# EAGLE design bt-audio-receiver (EAGLE 9.2.2)
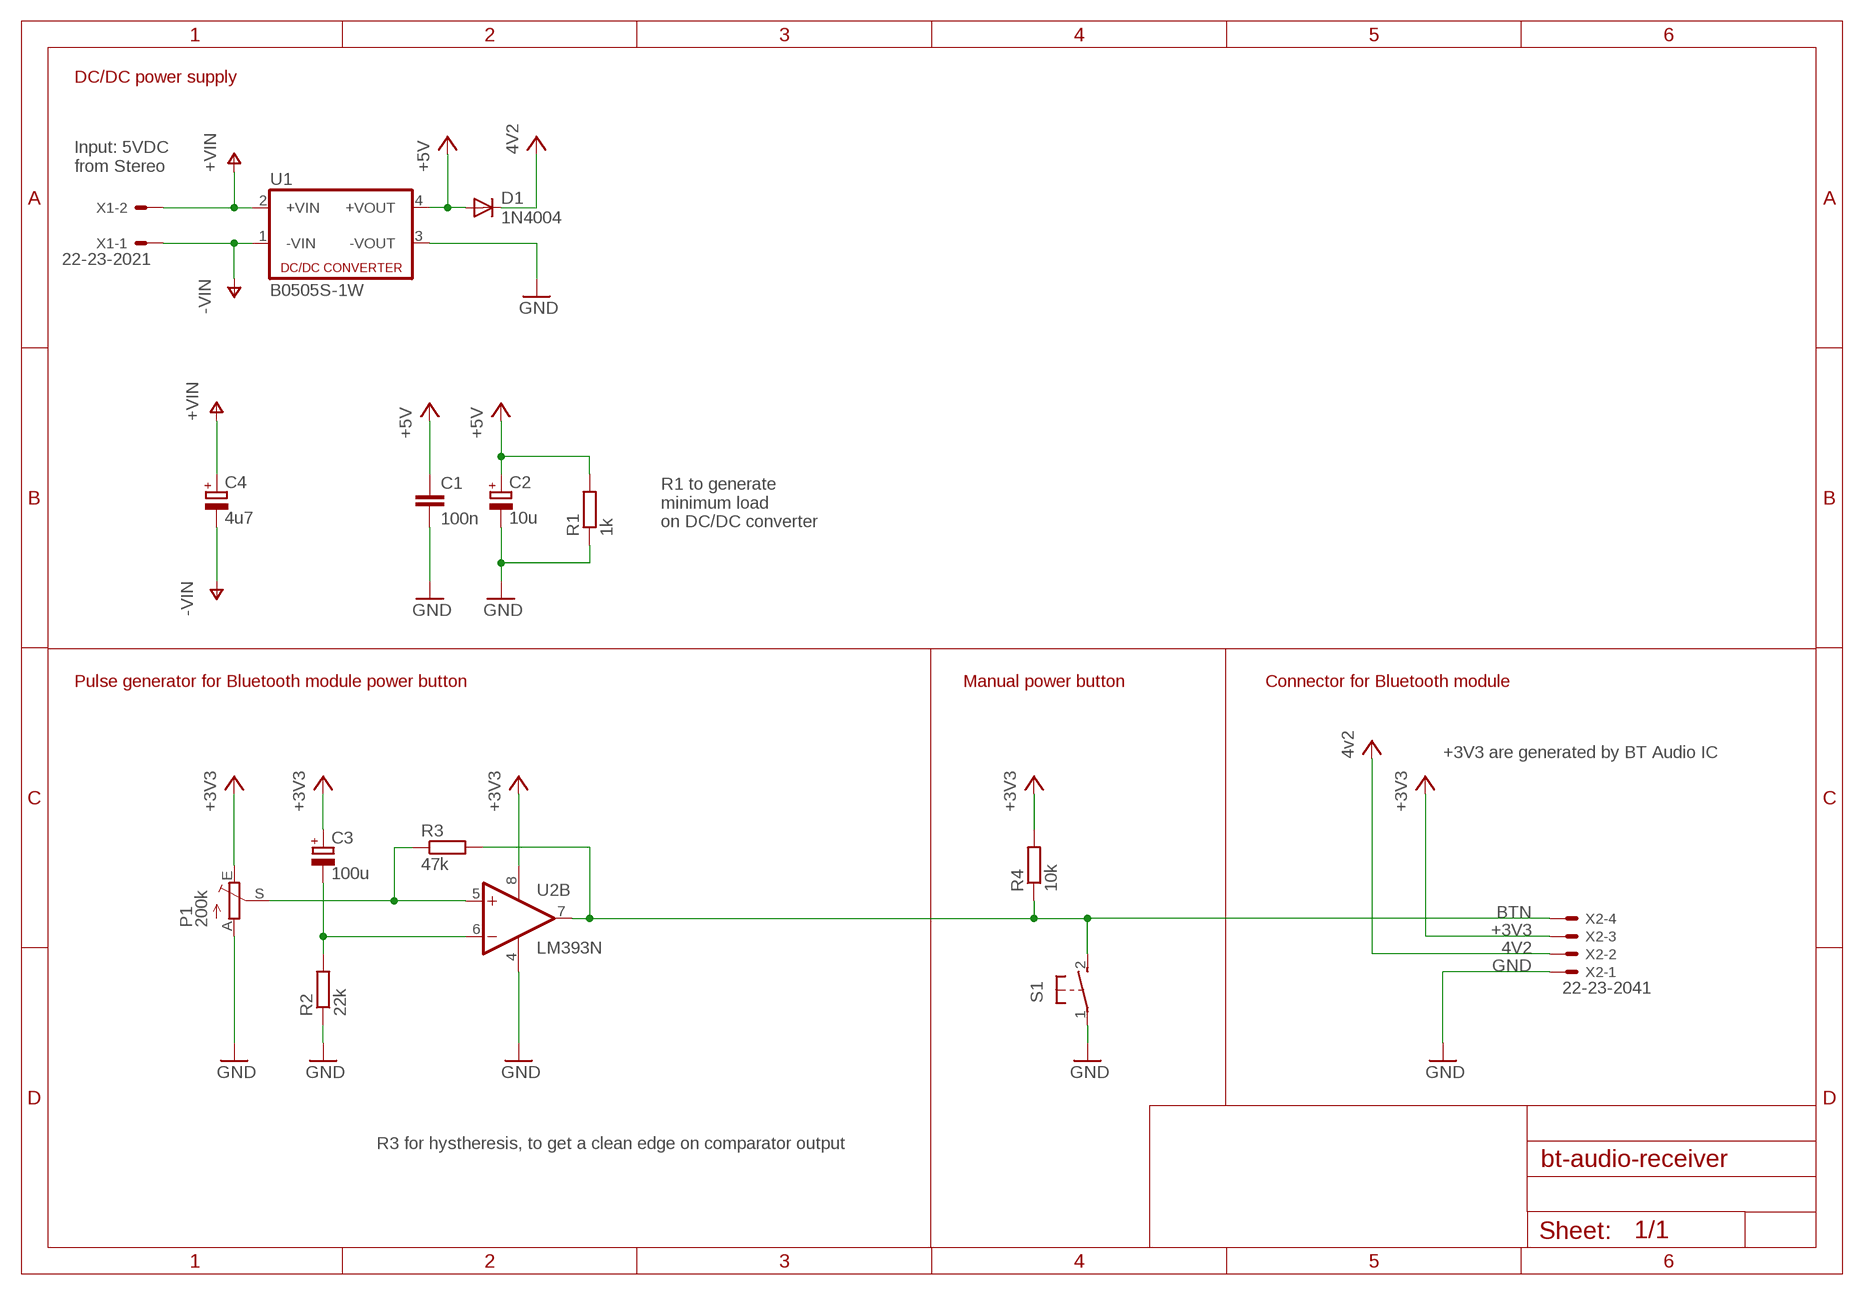
[diagram p0: schematic, sheet 1]

## Parts
C1  100n  C-EU025-025X050  [C025-025X050]
C2  10u  CPOL-EUE2-4  [E2-4]
C3  100u  CPOL-EUE2.5-5  [E2,5-5]
C4  4u7  CPOL-EUE2-4  [E2-4]
D1  1N4004  [DO41-10]
P1  200k  TRIM_EU-B25P  [B25P]
R1  1k  R-EU_0204/2V  [0204V]
R2  22k  R-EU_0204/7  [0204/7]
R3  47k  R-EU_0204/5  [0204/5]
R4  10k  R-EU_0204/2V  [0204V]
S1  DTS-3  [DTS-3]
U1  B0505S-1W  VA-0505S1  [4SIL]
U2  LM393N  [DIL08]
X1  22-23-2021  [22-23-2021]
X2  22-23-2041  [22-23-2041]

## Nets
4V2: D1.C X2.2 ; supply symbol labelled 4v2
+3V3: C3.+ P1.E R4.2 U2.8(P:V+) X2.3
+5V: C1.1 C2.+ D1.A R1.2 U1.4(+VOUT)
+VIN: C4.+ U1.2(+VIN) X1.2
-VIN: C4.- U1.1(-VIN) X1.1
BTN: R3.2 R4.1 S1.2 U2.7(B:OUT) X2.4
GND: C1.2 C2.- P1.A R1.1 R2.1 S1.1 U1.3(-VOUT) U2.4(P:V-) X2.1
N$1: C3.- R2.2 U2.6(B:-IN)
N$2: P1.S R3.1 U2.5(B:+IN)
Unconnected: U2.1(A:OUT) U2.2(A:-IN) U2.3(A:+IN)

## Notes on the sheet
- DC/DC power supply
- Input: 5VDC
  from Stereo
- R1 to generate
  minimum load
  on DC/DC converter
- Pulse generator for Bluetooth module power button | Manual power button | Connector for Bluetooth module
- +3V3 are generated by BT Audio IC
- R3 for hystheresis, to get a clean edge on comparator output

## Library data of the parts
C1 = rcl:C-EU: CAPACITOR, European symbol; SPICEPREFIX: C
C2-C4 = rcl:CPOL-EU: POLARIZED CAPACITOR, European symbol; SPICEPREFIX: C
D1 = diode:1N4004: DIODE general purpose rectifier, 1 A
P1 = pot:TRIM_EU-: POTENTIOMETER
R1-R4 = rcl:R-EU_: RESISTOR, European symbol; SPICEPREFIX: R
S1 = switch-tact:DTS-3
U1 = dc-dc-converter:VA-*?: DC DC Converter Single Output, 1 Watt Motien Technology Co.,Ltd. Source: Data sheet <http://www.motien.com.tw/data_sheet/VA-1%28H%29.pdf>; OC_FARNELL: unknown; OC_NEWARK: unknown
U2 = linear:LM393: COMPARATOR
X1 = con-molex:22-23-2021: .100" (2.54mm) Center Header - 2 Pin; MF: MOLEX; MPN: 22-23-2021; OC_FARNELL: 1462926; OC_NEWARK: 25C3832
X2 = con-molex:22-23-2041: .100" (2.54mm) Center Header - 4 Pin; MF: MOLEX; MPN: 22-23-2041; OC_FARNELL: 1462920; OC_NEWARK: 38C0355

## Board
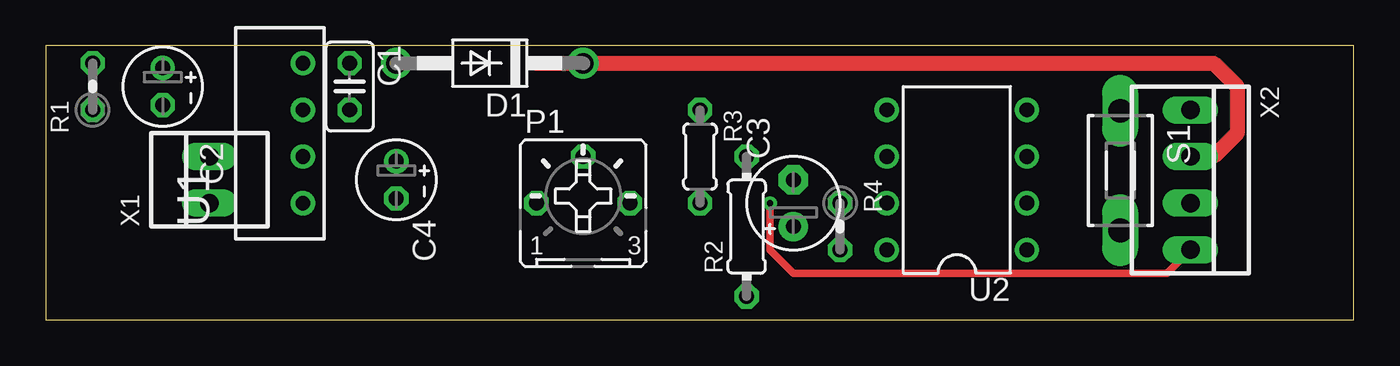
[diagram p1: board, top side]
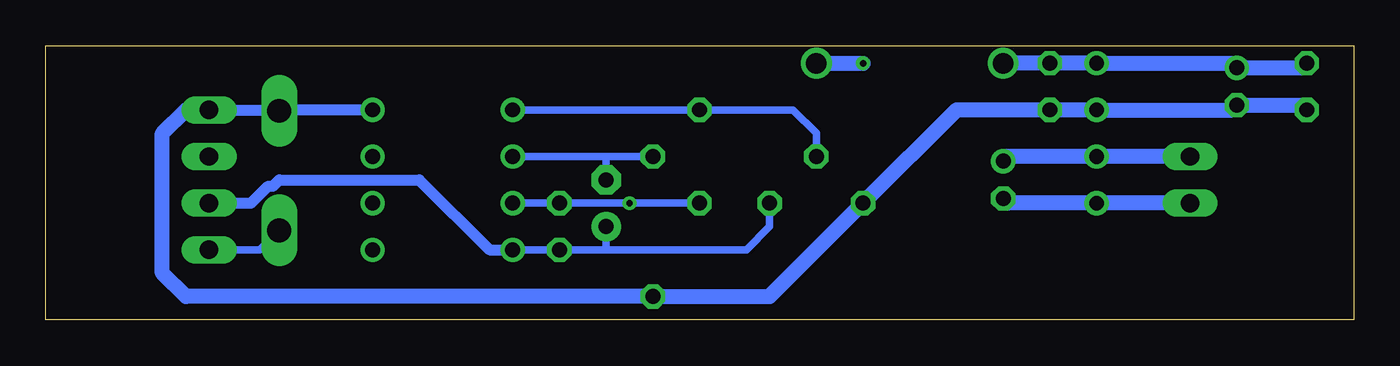
[diagram p2: board, bottom side, seen from below]

Size 71.1 x 14.91 mm. Coordinates in mm from the lower left corner, seen from the top.
Outline: 0,0 71.1,0 71.1,14.91 0,14.91 0,0
Copper layers (1*16): Top 0.035mm / dielectric 1.5mm / Bottom 0.035mm
Design rules "default": minimum track width 6mil, minimum drill 0.35mm, track to track 6mil, track to pad 6mil, pad to pad 6mil, via to via 6mil, smd to smd 6mil, copper to edge 40mil, drill to drill 6mil, minimum pad ring 10mil, minimum via ring 8mil, stop-mask expansion 4mil, vias tented up to drill 0mil, thermal gap 10mil

### Footprints (pad centres in the part's own frame; a part is rotated, then mirrored left to right if it is on the bottom)
C025-025X050 = drill 0.813 octagon: 1 -1.27,0; 2 1.27,0
E2-4 = drill 0.813 pad 1.27: + -1.016,0 | drill 0.813 pad 1.27 octagon: - 1.016,0
E2,5-5 = drill 0.813 pad 1.6: + -1.27,0 | drill 0.813 pad 1.6 octagon: - 1.27,0
DO41-10 = drill 1.118: A 5.08,0; C -5.08,0
B25P = drill 0.813 octagon: A -2.54,0; E 2.54,0; S 0,2.54
0204V = drill 0.813 octagon: 1 -1.27,0; 2 1.27,0
0204/7 = drill 0.813 octagon: 1 -3.81,0; 2 3.81,0
0204/5 = drill 0.813 octagon: 1 -2.54,0; 2 2.54,0
DTS-3 = drill 1.3 long: 1 -3.25,0; 2 3.25,0
4SIL = drill 0.8: 1 -3.81,0; 2 -1.27,0; 3 1.27,0; 4 3.81,0
DIL08 = drill 0.813 pad 1.27: 1 -3.81,-3.81; 2 -1.27,-3.81; 3 1.27,-3.81; 4 3.81,-3.81; 5 3.81,3.81; 6 1.27,3.81; 7 -1.27,3.81; 8 -3.81,3.81
22-23-2021 = drill 1 long: 1 -1.27,0; 2 1.27,0
22-23-2041 = drill 1 long: 1 -3.81,0; 2 -1.27,0; 3 1.27,0; 4 3.81,0

### Placement (x,y rotation side)
C1  16.51,12.7 270 top
C2  6.35,12.7 270 top
C3  40.64,6.35 90 top
C4  19.05,7.62 270 top
D1  24.13,13.97 180 top
P1  29.21,6.35 0 top
R1  2.54,12.7 90 top
R2  38.1,5.08 90 top
R3  35.56,8.89 270 top
R4  43.18,5.08 270 top
S1  58.42,8.13 270 top
U1  13.97,10.16 90 top
U2  49.53,7.62 90 top
X1  8.89,7.62 90 top
X2  62.23,7.62 270 top

### Tracks (layer width: path | path; a pad name or v marks a point on that pad's centre or on a via)
4V2  (via drill 0.35)
  Top 0.813: X2.2 63.5,8.89 64.77,10.16 64.77,12.7 63.5,13.97 v26.67,13.97
  Bottom 0.813: D1.C v26.67,13.97
+3V3
  Bottom 0.406: P1.E 31.75,5.08 33.02,3.81 40.64,3.81 | C3.+ 40.64,3.81 | 40.64,3.81 R4.2 U2.8
  Bottom 0.61: X2.3 59.95,6.35 59.01,7.29 58.76,7.29 58.42,7.62 50.8,7.62 46.99,3.81 U2.8
+5V
  Bottom 0.813: D1.A C1.1 U1.4 6.6,13.97 C2.+ 2.79,13.72 R1.2
+VIN
  Bottom 0.813: X1.2 U1.2 18.8,8.89 C4.+
-VIN
  Bottom 0.813: X1.1 U1.1 18.8,6.35 C4.-
BTN  (via drill 0.35)
  Top 0.406: X2.4 60.96,2.54 40.64,2.54 39.37,3.81 v39.37,6.35
  Bottom 0.406: X2.4 59.49,3.81 S1.2 | U2.7 R4.1 v39.37,6.35 R3.2
GND
  Bottom 0.61: X2.1 58.47,11.43 | U2.4 58.37,11.43
  Bottom 0.813: 58.47,11.43 S1.1 58.37,11.43 | R1.1 2.79,11.68 C2.- 6.6,11.43 U1.3 C1.2 21.59,11.43 P1.A 31.75,1.27 R2.1 63.5,1.27 64.77,2.54 64.77,10.16 63.5,11.43 X2.1
N$1
  Bottom 0.406: U2.6 40.64,8.89 | 40.64,8.89 R2.2 | C3.- 40.64,8.89
N$2
  Bottom 0.406: P1.S 29.21,10.16 30.48,11.43 R3.1 U2.5